# Altium schematic sheet Expansion Headers.SchDoc: Modular Parent Motherboard
size Letter; DrawnBy: MTAN; Organization: Altium Limited; DocumentNumber: 2; Revision: B; SheetNumber: 2; SheetTotal: 6
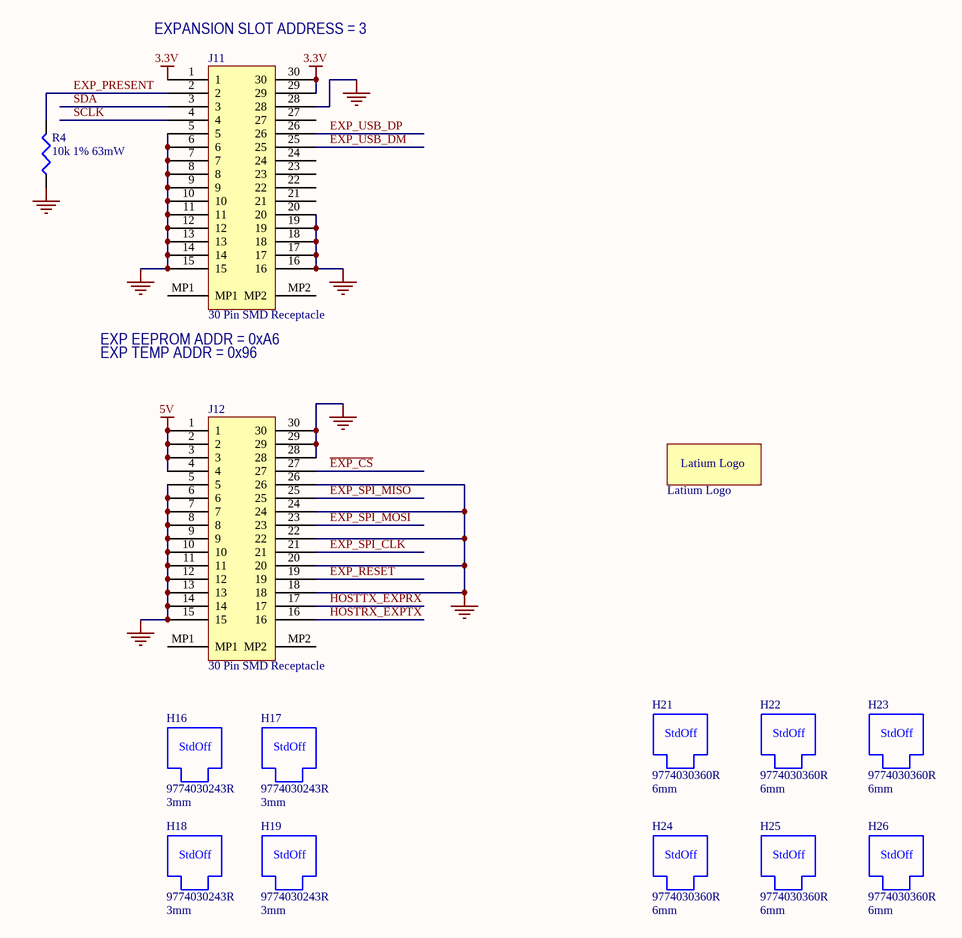
[diagram p0: Expansion Headers.SchDoc]

## Parts
H16  9774030243R  Height: 3mm  [Wurth 9774030243R]
H17  9774030243R  Height: 3mm  [Wurth 9774030243R]
H18  9774030243R  Height: 3mm  [Wurth 9774030243R]
H19  9774030243R  Height: 3mm  [Wurth 9774030243R]
H21  9774030360R  Height: 6mm  [Wurth 9774060360R]
H22  9774030360R  Height: 6mm  [Wurth 9774060360R]
H23  9774030360R  Height: 6mm  [Wurth 9774060360R]
H24  9774030360R  Height: 6mm  [Wurth 9774060360R]
H25  9774030360R  Height: 6mm  [Wurth 9774060360R]
H26  9774030360R  Height: 6mm  [Wurth 9774060360R]
H38  Latium Logo  [LatiumLogo]  (no BOM)
J11  30 Pin SMD Receptacle  [10132798-031100LF]
J12  30 Pin SMD Receptacle  [10132798-031100LF]
R4  10k 1% 63mW  [RESC1005L]

## Nets
3.3V: J11.1 J11.29 J11.30
5V: J12.1 J12.2 J12.3 J12.4
GND: J11.5 J11.6 J11.7 J11.8 J11.9 J11.10 J11.11 J11.12 J11.13 J11.14 J11.15 J11.16 J11.17 J11.18 J11.19 J11.20 J11.28 J12.5 J12.6 J12.7 J12.8 J12.9 J12.10 J12.11 J12.12 J12.13 J12.14 J12.15 J12.18 J12.20 J12.22 J12.24 J12.26 J12.28 J12.29 J12.30 R4.1
~{EXP_CS}: J12.27
EXP_PRESENT: J11.2 R4.2
EXP_RESET: J12.19
EXP_SPI_CLK: J12.21
EXP_SPI_MISO: J12.25
EXP_SPI_MOSI: J12.23
EXP_USB_DM: J11.25
EXP_USB_DP: J11.26
HOSTRX_EXPTX: J12.16
HOSTTX_EXPRX: J12.17
SCLK: J11.4
SDA: J11.3

Not connected (* = marked no-connect by the designer): J11 21 22 23 24 27 MP1 MP2; J12 MP1 MP2

## Notes on the sheet
- (near J11) EXPANSION SLOT ADDRESS = 3
- (near J11) EXP EEPROM ADDR = 0xA6
- EXP TEMP ADDR = 0x96
- Title
- Drawn By:
- Date:
- Time:
- Revision:
- Sheet
- of
- The Latium Group of Companies
- 1312 10 Street
- Nisku, Alberta
- T9E 8K2
- Canada
- File:
- (in symbol SMD M3 Spacer) StdOff

## Library data of the parts
H16-H19 = SMD M3 Spacer: ROUND STANDOFF M2X0.4 STEEL 3MM; Manufacturer: Wurth Electronics Inc; Supplier 1: Digi-Key; Value: 9774030243R; Manufacturer Part Number: 9774030243R; ComponentLink1Description: Drawing; ComponentLink1URL: S:\Hardware\Data Sheets\Passive\Standoffs\Wurth 9774070360R.pdf; Supplier 1 Part Number: 732-7085-1-ND
H21-H26 = SMD M3 Spacer: ROUND STANDOFF M3X0.5 STEEL 6MM; Manufacturer: Wurth Electronics Inc; Manufacturer Part Number: 9774060360R; Supplier 1: Digi-Key; Value: 9774030360R; ComponentLink1Description: Drawing; ComponentLink1URL: S:\Hardware\Data Sheets\Passive\Spacers\Wurth 9774060360R.pdf; Supplier 1 Part Number: 732-5273-1-ND
J11 J12 = Amphenol 30 Pos BergStak Plug: CONN RCPT 30POS SMD GOLD; Manufacturer: Amphenol ICC (FCI); Note: Mates with 10132797-031100LF plug 3mm between board height; Value: 30 Pin SMD Receptacle; Manufacturer Part Number: 10132798-031100LF; Supplier 1: Digi-Key; Supplier 1 Part Number: 609-5030-1-ND
R4 = Res3: Resistor; Value: 10k 1% 63mW
H38 = Latium Logo: Value: Latium Logo